# Altium schematic sheet SCREEN.SchDoc
size A4; SheetNumber: 1; SheetTotal: 3
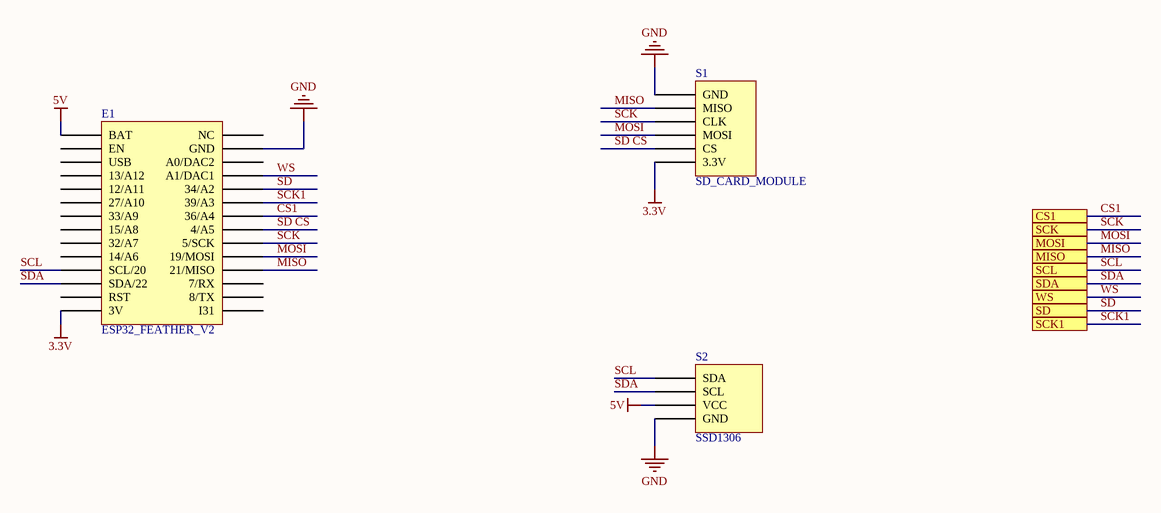
[diagram p0: SCREEN.SchDoc]

## Parts
E1  ESP32_FEATHER_V2  [ESP32_FEATHER_V2]
S1  SD_CARD_MODULE  [MICRO_SD_CARD_MODULE]
S2  SSD1306  [SSD1306]

## Ports
CS1, MISO, MOSI, SCK, SCK1, SCL, SD, SDA, WS

## Nets
3.3V: E1.15(3V) S1.6(3.3V)
5V: E1.17(BAT) S2.3(VCC)
GND: E1.13(GND) S1.1(GND) S2.4(GND)
CS1: E1.8(36/A4) ; port CS1
MISO: E1.4(21/MISO) S1.2(MISO) ; port MISO
MOSI: E1.5(19/MOSI) S1.4(MOSI) ; port MOSI
SCK: E1.6(5/SCK) S1.3(CLK) ; port SCK
SCK1: E1.9(39/A3) ; port SCK1
SCL: E1.27(SCL/20) S2.1(SDA) ; port SCL
SD: E1.10(34/A2) ; port SD
SD CS: E1.7(4/A5) S1.5(CS)
SDA: E1.28(SDA/22) S2.2(SCL) ; port SDA
WS: E1.11(A1/DAC1) ; port WS

Not connected (* = marked no-connect by the designer): E1 1(I31) 2(8/TX) 3(7/RX) 12(A0/DAC2) 14(NC) 16(RST) 18(EN) 19(USB) 20(13/A12) 21(12/A11) 22(27/A10) 23(33/A9) 24(15/A8) 25(32/A7) 26(14/A6)

## Library data of the parts
E1 = ESP32_FEATHER_V2: ESP32 Feather V2
S2 = SSD1306: 0.96 inch, 128x64